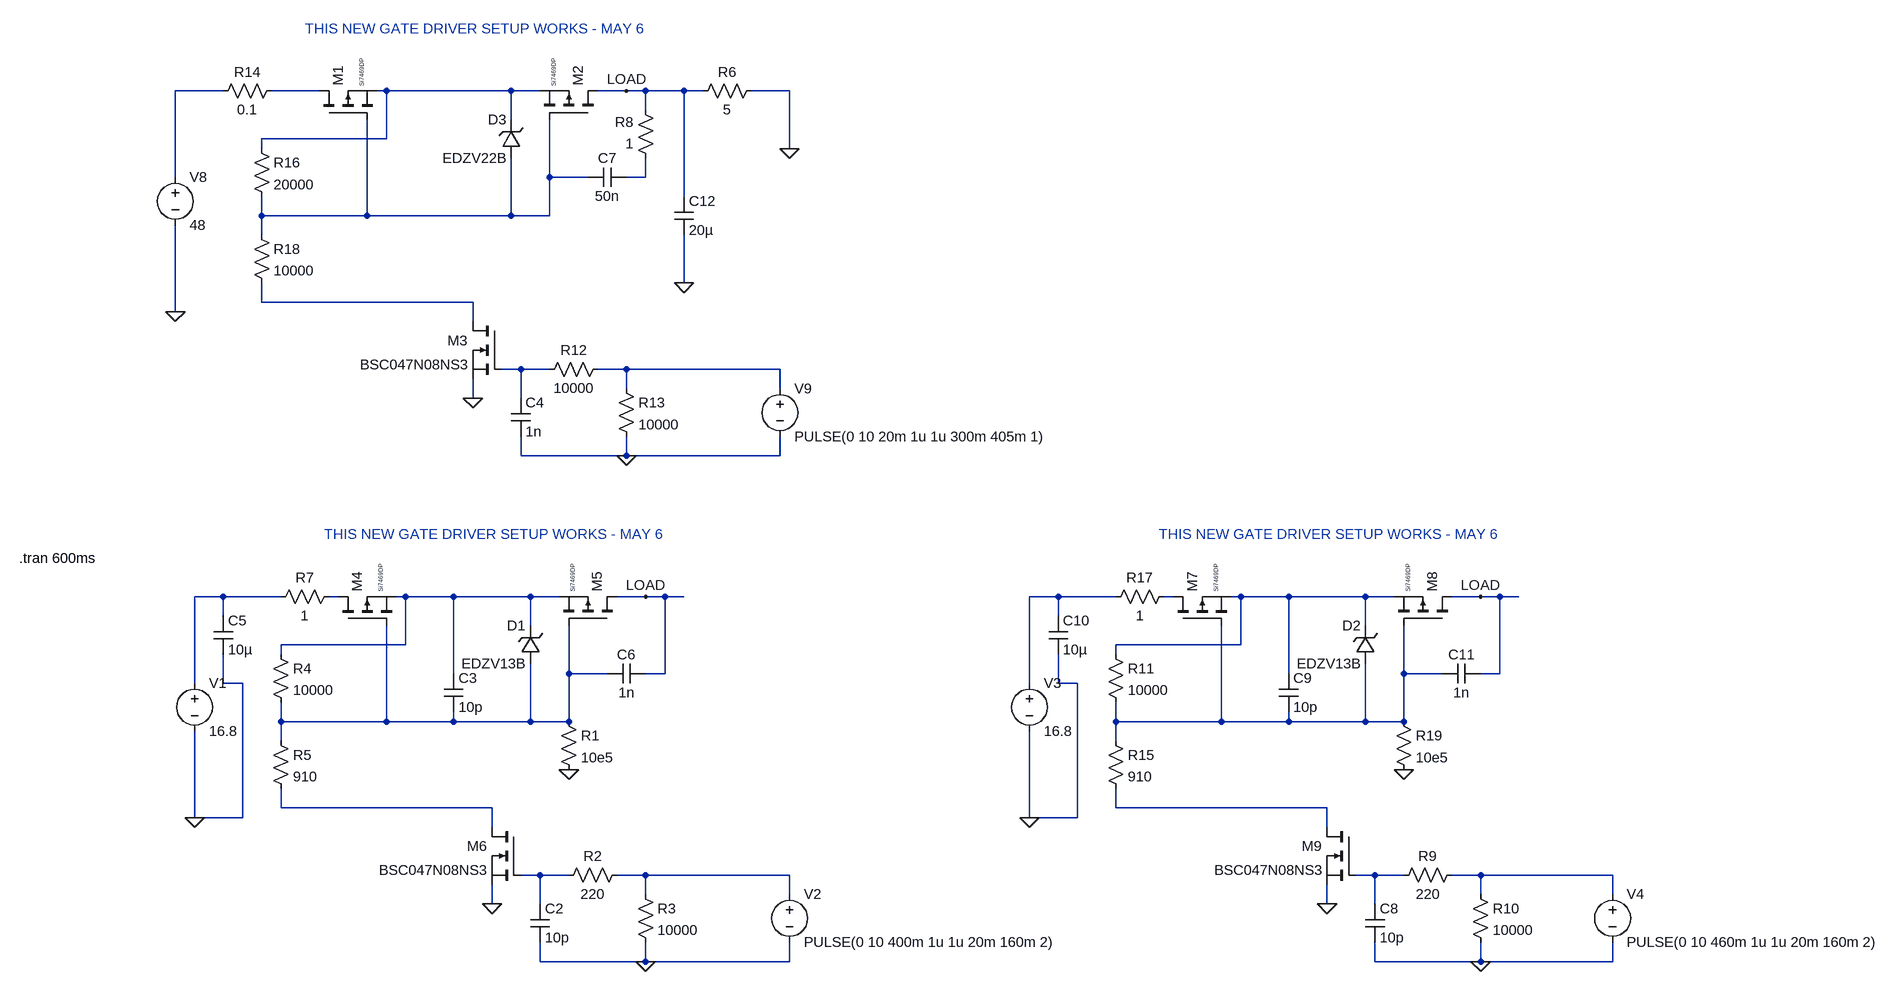
[diagram p0: schematic PMOS Bidirectional Switch Prototype 3.asc]
PMOS Bidirectional Switch Prototype 3.asc, the LTspice schematic file:
Version 4.1
SHEET 1 2720 2516
WIRE -768 400 -848 400
WIRE -608 400 -688 400
WIRE -496 400 -512 400
WIRE -288 400 -496 400
WIRE -240 400 -288 400
WIRE -96 400 -144 400
WIRE -64 400 -96 400
WIRE 0 400 -64 400
WIRE 32 400 0 400
WIRE 176 400 112 400
WIRE -64 432 -64 400
WIRE -288 448 -288 400
WIRE -496 480 -496 400
WIRE -496 480 -704 480
WIRE -704 496 -704 480
WIRE 176 496 176 400
WIRE -848 544 -848 400
WIRE -224 544 -224 448
WIRE -160 544 -224 544
WIRE -64 544 -64 512
WIRE -64 544 -96 544
WIRE 0 576 0 400
WIRE -704 608 -704 576
WIRE -528 608 -528 448
WIRE -528 608 -704 608
WIRE -288 608 -288 512
WIRE -288 608 -528 608
WIRE -224 608 -224 544
WIRE -224 608 -288 608
WIRE -704 640 -704 608
WIRE 0 720 0 640
WIRE -704 752 -704 720
WIRE -352 752 -704 752
WIRE -848 768 -848 624
WIRE -352 784 -352 752
WIRE -272 864 -304 864
WIRE -224 864 -272 864
WIRE -96 864 -144 864
WIRE 160 864 -96 864
WIRE -96 896 -96 864
WIRE 160 896 160 864
WIRE -352 912 -352 880
WIRE -272 912 -272 864
WIRE -272 1008 -272 976
WIRE -96 1008 -96 976
WIRE -96 1008 -272 1008
WIRE 160 1008 160 976
WIRE 160 1008 -96 1008
WIRE -768 1248 -816 1248
WIRE -672 1248 -768 1248
WIRE -576 1248 -592 1248
WIRE -464 1248 -480 1248
WIRE -384 1248 -464 1248
WIRE -256 1248 -384 1248
WIRE -208 1248 -256 1248
WIRE -64 1248 -112 1248
WIRE -32 1248 -64 1248
WIRE 0 1248 -32 1248
WIRE 624 1248 576 1248
WIRE 720 1248 624 1248
WIRE 816 1248 800 1248
WIRE 928 1248 912 1248
WIRE 1008 1248 928 1248
WIRE 1136 1248 1008 1248
WIRE 1184 1248 1136 1248
WIRE 1328 1248 1280 1248
WIRE 1360 1248 1328 1248
WIRE 1392 1248 1360 1248
WIRE -768 1280 -768 1248
WIRE 624 1280 624 1248
WIRE -256 1296 -256 1248
WIRE 1136 1296 1136 1248
WIRE -464 1328 -464 1248
WIRE -464 1328 -672 1328
WIRE 928 1328 928 1248
WIRE 928 1328 720 1328
WIRE -672 1344 -672 1328
WIRE 720 1344 720 1328
WIRE -384 1376 -384 1248
WIRE -192 1376 -192 1296
WIRE -128 1376 -192 1376
WIRE -32 1376 -32 1248
WIRE -32 1376 -64 1376
WIRE 1008 1376 1008 1248
WIRE 1200 1376 1200 1296
WIRE 1264 1376 1200 1376
WIRE 1360 1376 1360 1248
WIRE 1360 1376 1328 1376
WIRE -816 1392 -816 1248
WIRE -768 1392 -768 1344
WIRE -736 1392 -768 1392
WIRE 576 1392 576 1248
WIRE 624 1392 624 1344
WIRE 656 1392 624 1392
WIRE -672 1456 -672 1424
WIRE -496 1456 -496 1296
WIRE -496 1456 -672 1456
WIRE -384 1456 -384 1440
WIRE -384 1456 -496 1456
WIRE -256 1456 -256 1360
WIRE -256 1456 -384 1456
WIRE -192 1456 -192 1376
WIRE -192 1456 -256 1456
WIRE 720 1456 720 1424
WIRE 896 1456 896 1296
WIRE 896 1456 720 1456
WIRE 1008 1456 1008 1440
WIRE 1008 1456 896 1456
WIRE 1136 1456 1136 1360
WIRE 1136 1456 1008 1456
WIRE 1200 1456 1200 1376
WIRE 1200 1456 1136 1456
WIRE -672 1488 -672 1456
WIRE 720 1488 720 1456
WIRE -672 1600 -672 1568
WIRE -320 1600 -672 1600
WIRE 720 1600 720 1568
WIRE 1072 1600 720 1600
WIRE -816 1616 -816 1472
WIRE -736 1616 -736 1392
WIRE -736 1616 -816 1616
WIRE 576 1616 576 1472
WIRE 656 1616 656 1392
WIRE 656 1616 576 1616
WIRE -320 1632 -320 1600
WIRE 1072 1632 1072 1600
WIRE -240 1712 -272 1712
WIRE -192 1712 -240 1712
WIRE -64 1712 -112 1712
WIRE 176 1712 -64 1712
WIRE 1152 1712 1120 1712
WIRE 1200 1712 1152 1712
WIRE 1328 1712 1280 1712
WIRE 1568 1712 1328 1712
WIRE -64 1744 -64 1712
WIRE 176 1744 176 1712
WIRE 1328 1744 1328 1712
WIRE 1568 1744 1568 1712
WIRE -320 1760 -320 1728
WIRE -240 1760 -240 1712
WIRE 1072 1760 1072 1728
WIRE 1152 1760 1152 1712
WIRE -240 1856 -240 1824
WIRE -64 1856 -64 1824
WIRE -64 1856 -240 1856
WIRE 176 1856 176 1824
WIRE 176 1856 -64 1856
WIRE 1152 1856 1152 1824
WIRE 1328 1856 1328 1824
WIRE 1328 1856 1152 1856
WIRE 1568 1856 1568 1824
WIRE 1568 1856 1328 1856
FLAG 176 496 0
FLAG -848 768 0
FLAG -352 912 0
FLAG -96 1008 0
FLAG -96 400 LOAD
FLAG -816 1616 0
FLAG -320 1760 0
FLAG -64 1856 0
FLAG -64 1248 LOAD
FLAG -192 1536 0
FLAG 576 1616 0
FLAG 1072 1760 0
FLAG 1328 1856 0
FLAG 1328 1248 LOAD
FLAG 1200 1536 0
FLAG 0 720 0
SYMBOL res 128 384 R90
WINDOW 0 0 56 VBottom 2
WINDOW 3 32 56 VTop 2
SYMATTR InstName R6
SYMATTR Value 5
SYMBOL voltage -848 528 R0
WINDOW 123 0 0 Left 0
WINDOW 39 24 124 Left 2
SYMATTR InstName V8
SYMATTR Value 48
SYMBOL voltage 160 880 R0
WINDOW 123 0 0 Left 0
WINDOW 39 0 0 Left 0
SYMATTR InstName V9
SYMATTR Value PULSE(0 10 20m 1u 1u 300m 405m 1)
SYMBOL res -128 848 R90
WINDOW 0 0 56 VBottom 2
WINDOW 3 32 56 VTop 2
SYMATTR InstName R12
SYMATTR Value 10000
SYMBOL res -112 880 R0
SYMATTR InstName R13
SYMATTR Value 10000
SYMBOL cap -288 912 R0
SYMATTR InstName C4
SYMATTR Value 1n
SYMBOL res -720 480 R0
SYMATTR InstName R16
SYMATTR Value 20000
SYMBOL res -720 624 R0
SYMATTR InstName R18
SYMATTR Value 10000
SYMBOL zener -272 512 R180
WINDOW 0 24 64 Left 2
WINDOW 3 24 0 Left 2
SYMATTR InstName D3
SYMATTR Value EDZV22B
SYMBOL res -672 384 R90
WINDOW 0 0 56 VBottom 2
WINDOW 3 32 56 VTop 2
SYMATTR InstName R14
SYMATTR Value 0.1
SYMBOL pmos -608 448 R270
WINDOW 3 56 72 Left 0
SYMATTR Value Si7469DP
SYMATTR InstName M1
SYMBOL pmos -144 448 M270
WINDOW 3 56 72 Left 0
SYMATTR Value Si7469DP
SYMATTR InstName M2
SYMBOL nmos -304 784 M0
SYMATTR InstName M3
SYMATTR Value BSC047N08NS3
SYMBOL voltage -816 1376 R0
WINDOW 123 0 0 Left 0
WINDOW 39 24 124 Left 2
SYMATTR InstName V1
SYMATTR Value 16.8
SYMBOL res -96 1696 R90
WINDOW 0 0 56 VBottom 2
WINDOW 3 32 56 VTop 2
SYMATTR InstName R2
SYMATTR Value 220
SYMBOL res -80 1728 R0
SYMATTR InstName R3
SYMATTR Value 10000
SYMBOL cap -256 1760 R0
SYMATTR InstName C2
SYMATTR Value 10p
SYMBOL res -688 1328 R0
SYMATTR InstName R4
SYMATTR Value 10000
SYMBOL res -688 1472 R0
SYMATTR InstName R5
SYMATTR Value 910
SYMBOL zener -240 1360 R180
WINDOW 0 24 64 Left 2
WINDOW 3 24 0 Left 2
SYMATTR InstName D1
SYMATTR Value EDZV13B
SYMBOL res -576 1232 R90
WINDOW 0 0 56 VBottom 2
WINDOW 3 32 56 VTop 2
SYMATTR InstName R7
SYMATTR Value 1
SYMBOL cap -400 1376 R0
SYMATTR InstName C3
SYMATTR Value 10p
SYMBOL pmos -576 1296 R270
WINDOW 3 56 72 Left 0
SYMATTR Value Si7469DP
SYMATTR InstName M4
SYMBOL pmos -112 1296 M270
WINDOW 3 56 72 Left 0
SYMATTR Value Si7469DP
SYMATTR InstName M5
SYMBOL nmos -272 1632 M0
SYMATTR InstName M6
SYMATTR Value BSC047N08NS3
SYMBOL res -208 1440 R0
SYMATTR InstName R1
SYMATTR Value 10e5
SYMBOL cap -784 1280 R0
SYMATTR InstName C5
SYMATTR Value 10µ
SYMBOL cap -64 1360 R90
WINDOW 0 0 32 VBottom 2
WINDOW 3 32 32 VTop 2
SYMATTR InstName C6
SYMATTR Value 1n
SYMBOL cap -96 528 R90
WINDOW 0 0 32 VBottom 2
WINDOW 3 32 32 VTop 2
SYMATTR InstName C7
SYMATTR Value 50n
SYMBOL voltage 176 1728 R0
WINDOW 123 0 0 Left 0
WINDOW 39 0 0 Left 0
SYMATTR InstName V2
SYMATTR Value PULSE(0 10 400m 1u 1u 20m 160m 2)
SYMBOL voltage 576 1376 R0
WINDOW 123 0 0 Left 0
WINDOW 39 24 124 Left 2
SYMATTR InstName V3
SYMATTR Value 16.8
SYMBOL res 1296 1696 R90
WINDOW 0 0 56 VBottom 2
WINDOW 3 32 56 VTop 2
SYMATTR InstName R9
SYMATTR Value 220
SYMBOL res 1312 1728 R0
SYMATTR InstName R10
SYMATTR Value 10000
SYMBOL cap 1136 1760 R0
SYMATTR InstName C8
SYMATTR Value 10p
SYMBOL res 704 1328 R0
SYMATTR InstName R11
SYMATTR Value 10000
SYMBOL res 704 1472 R0
SYMATTR InstName R15
SYMATTR Value 910
SYMBOL zener 1152 1360 R180
WINDOW 0 24 64 Left 2
WINDOW 3 24 0 Left 2
SYMATTR InstName D2
SYMATTR Value EDZV13B
SYMBOL res 816 1232 R90
WINDOW 0 0 56 VBottom 2
WINDOW 3 32 56 VTop 2
SYMATTR InstName R17
SYMATTR Value 1
SYMBOL cap 992 1376 R0
SYMATTR InstName C9
SYMATTR Value 10p
SYMBOL pmos 816 1296 R270
WINDOW 3 56 72 Left 0
SYMATTR Value Si7469DP
SYMATTR InstName M7
SYMBOL pmos 1280 1296 M270
WINDOW 3 56 72 Left 0
SYMATTR Value Si7469DP
SYMATTR InstName M8
SYMBOL nmos 1120 1632 M0
SYMATTR InstName M9
SYMATTR Value BSC047N08NS3
SYMBOL res 1184 1440 R0
SYMATTR InstName R19
SYMATTR Value 10e5
SYMBOL cap 608 1280 R0
SYMATTR InstName C10
SYMATTR Value 10µ
SYMBOL cap 1328 1360 R90
WINDOW 0 0 32 VBottom 2
WINDOW 3 32 32 VTop 2
SYMATTR InstName C11
SYMATTR Value 1n
SYMBOL voltage 1568 1728 R0
WINDOW 123 0 0 Left 0
WINDOW 39 0 0 Left 0
SYMATTR InstName V4
SYMATTR Value PULSE(0 10 460m 1u 1u 20m 160m 2)
SYMBOL cap -16 576 R0
SYMATTR InstName C12
SYMATTR Value 20µ
SYMBOL res -48 528 R180
WINDOW 0 36 76 Left 2
WINDOW 3 36 40 Left 2
SYMATTR InstName R8
SYMATTR Value 1
TEXT -632 296 Left 2 ;THIS NEW GATE DRIVER SETUP WORKS - MAY 6
TEXT -1280 1184 Left 2 !.tran 600ms
TEXT -600 1144 Left 2 ;THIS NEW GATE DRIVER SETUP WORKS - MAY 6
TEXT 792 1144 Left 2 ;THIS NEW GATE DRIVER SETUP WORKS - MAY 6

The netlist it stands for:
* PMOS Bidirectional Switch Prototype 3.asc
R6 0 LOAD 5
V8 N001 0 48
V9 N008 0 PULSE(0 10 20m 1u 1u 300m 405m 1)
R12 N008 N007 10000
R13 N008 0 10000
C4 N007 0 1n
R16 N003 N004 20000
R18 N004 N006 10000
D3 N004 N003 EDZV22B
R14 N002 N001 0.1
M1 N002 N004 N003 N003 Si7469DP
M2 LOAD N004 N003 N003 Si7469DP
M3 N006 N007 0 0 BSC047N08NS3
V1 N009 0 16.8
R2 N020 N019 220
R3 N020 0 10000
C2 N019 0 10p
R4 N011 N015 10000
R5 N015 N017 910
D1 N015 N011 EDZV13B
R7 N010 N009 1
C3 N011 N015 10p
M4 N010 N015 N011 N011 Si7469DP
M5 LOAD N015 N011 N011 Si7469DP
M6 N017 N019 0 0 BSC047N08NS3
R1 N015 0 10e5
C5 N009 0 10µ
C6 LOAD N015 1n
C7 N005 N004 50n
V2 N020 0 PULSE(0 10 400m 1u 1u 20m 160m 2)
V3 N012 0 16.8
R9 N022 N021 220
R10 N022 0 10000
C8 N021 0 10p
R11 N014 N016 10000
R15 N016 N018 910
D2 N016 N014 EDZV13B
R17 N013 N012 1
C9 N014 N016 10p
M7 N013 N016 N014 N014 Si7469DP
M8 LOAD N016 N014 N014 Si7469DP
M9 N018 N021 0 0 BSC047N08NS3
R19 N016 0 10e5
C10 N012 0 10µ
C11 LOAD N016 1n
V4 N022 0 PULSE(0 10 460m 1u 1u 20m 160m 2)
C12 LOAD 0 20µ
R8 N005 LOAD 1
.model D D
.lib standard.dio
.model NMOS NMOS
.model PMOS PMOS
.lib standard.mos
* THIS NEW GATE DRIVER SETUP WORKS - MAY 6
.tran 600ms
* THIS NEW GATE DRIVER SETUP WORKS - MAY 6
* THIS NEW GATE DRIVER SETUP WORKS - MAY 6
.backanno
.end